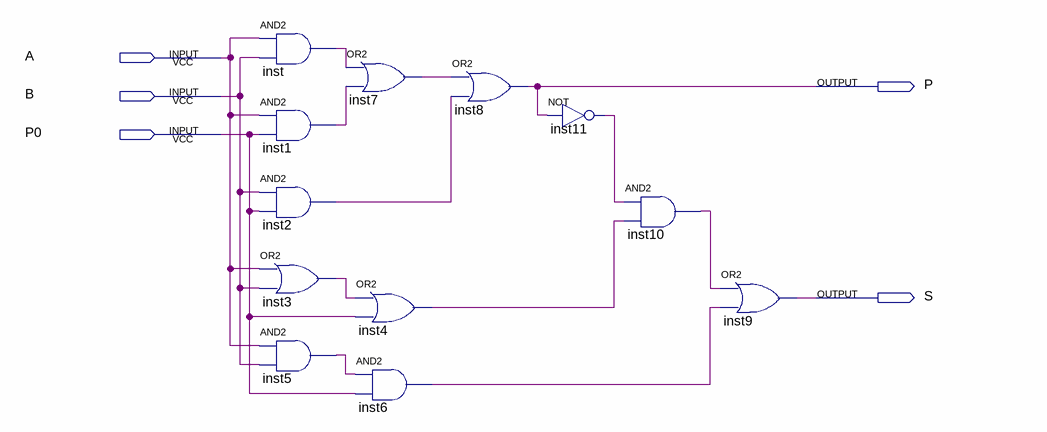
[diagram p0: schematic sheet]
// Quartus schematic PR1.bdf as structural Verilog: 12 symbols, 5 pins
module PR1 (
  input  A,
  input  B,
  input  P0,
  output P,
  output S
);

  wire inst1_out, inst2_out, inst3_out, inst4_out, inst5_out, inst6_out, inst7_out, inst10_out, inst11_out,
       inst_out;

  and inst (inst_out, A, B);
  and inst1 (inst1_out, A, P0);
  and inst2 (inst2_out, B, P0);
  or inst3 (inst3_out, A, B);
  and inst5 (inst5_out, A, B);
  or inst7 (inst7_out, inst_out, inst1_out);
  or inst4 (inst4_out, inst3_out, P0);
  and inst6 (inst6_out, inst5_out, P0);
  or inst8 (P, inst7_out, inst2_out);
  not inst11 (inst11_out, P);
  and inst10 (inst10_out, inst11_out, inst4_out);
  or inst9 (S, inst10_out, inst6_out);
endmodule
